# EAGLE schematic sch_v.1 (EAGLE 9.4.2)
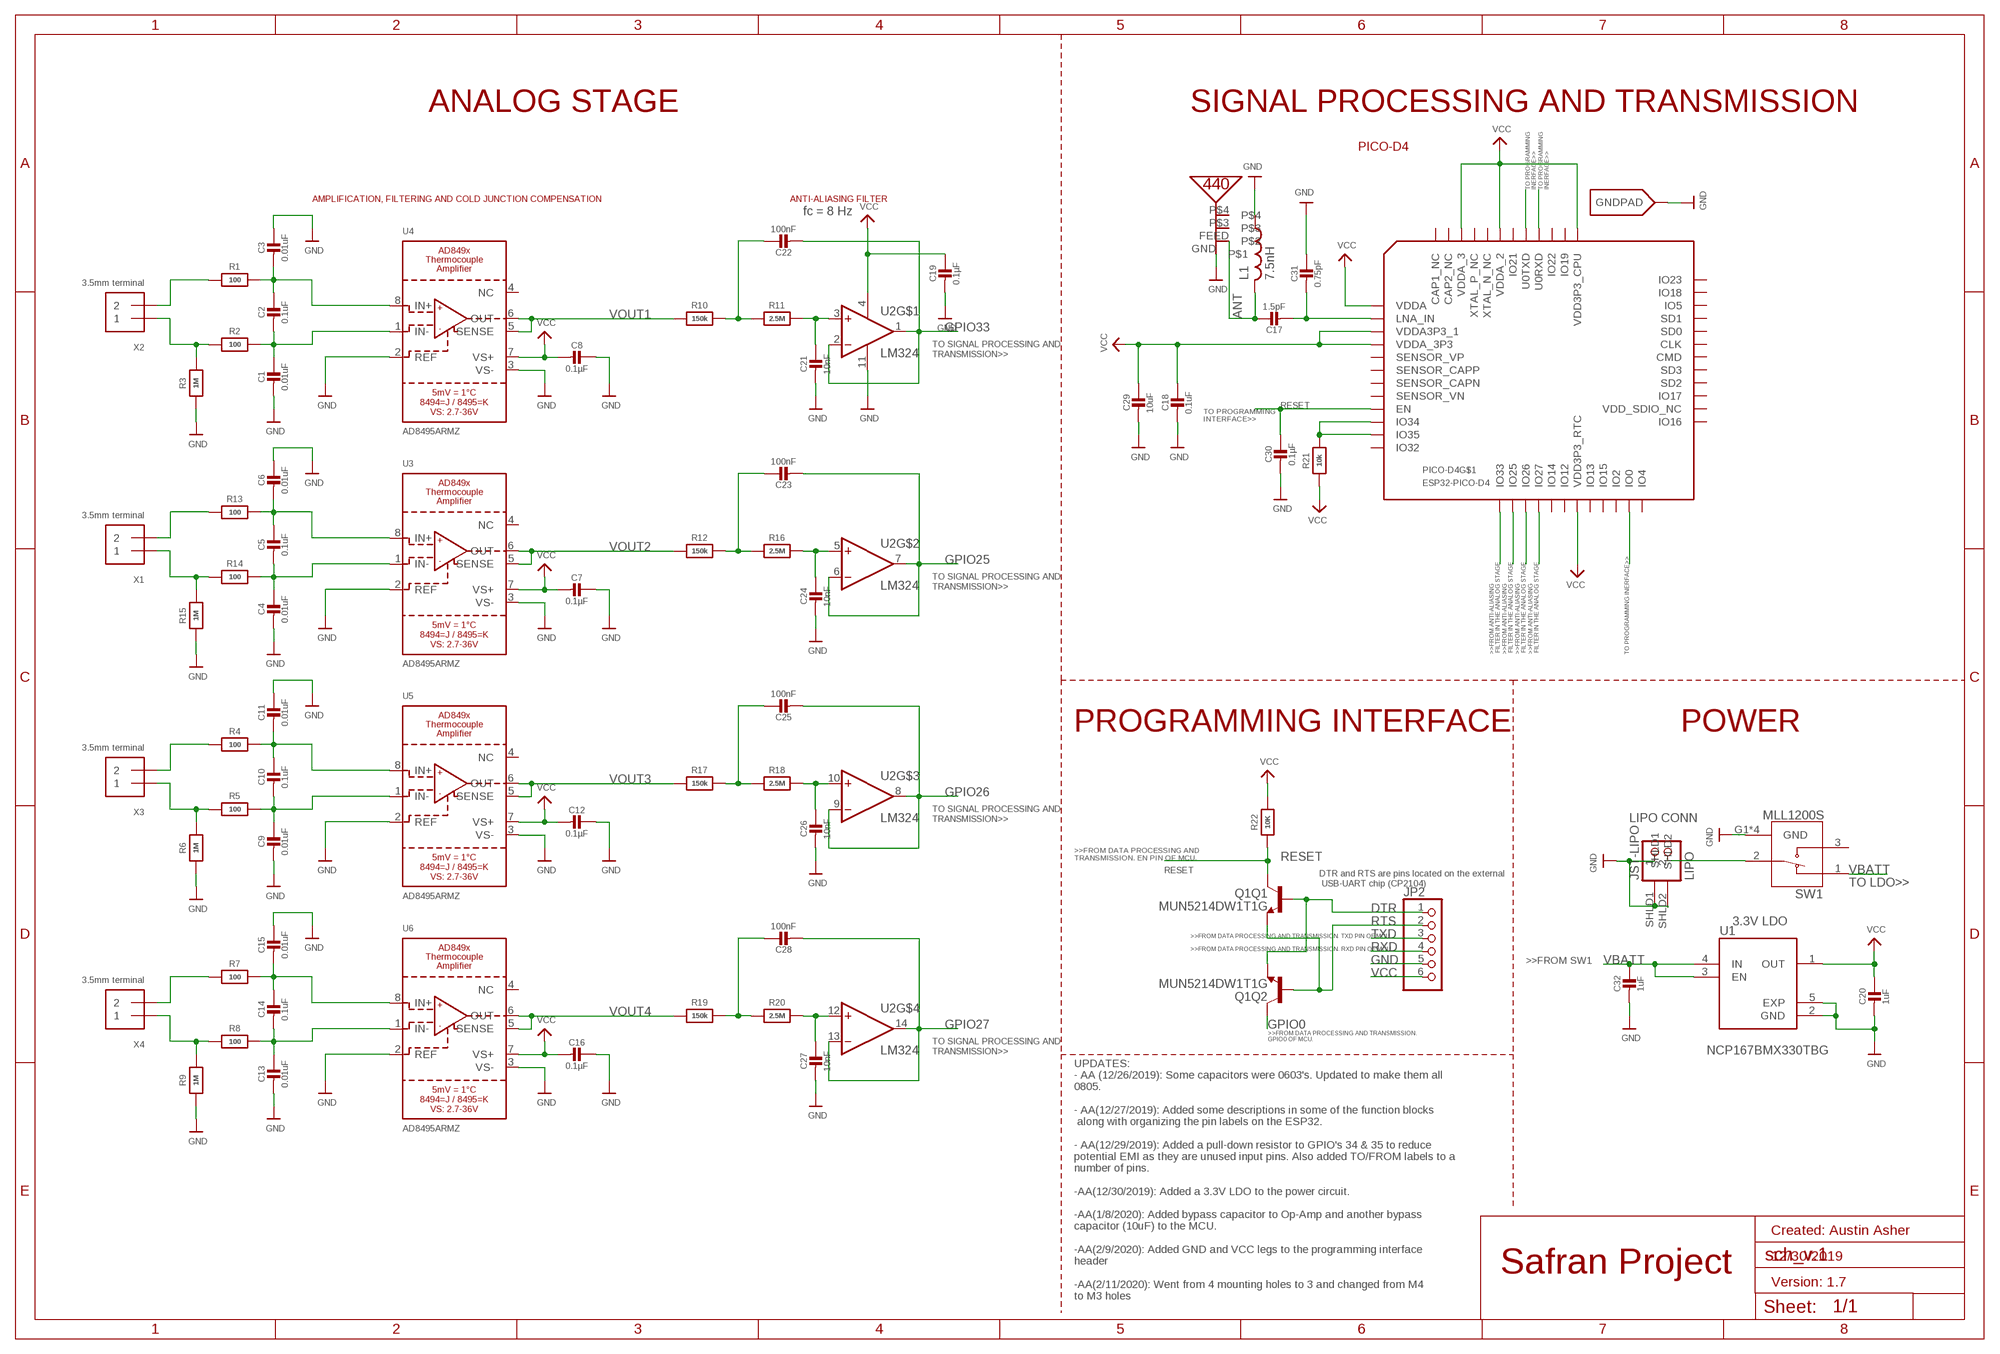
[diagram p0: schematic, sheet 1]

## Parts
C1  0.01uF  CAP_CERAMIC0805-NOOUTLINE  [0805-NO@1]
C2  0.1uF  CAP_CERAMIC0805-NOOUTLINE  [0805-NO@1]
C3  0.01uF  CAP_CERAMIC0805-NOOUTLINE  [0805-NO@1]
C4  0.01uF  CAP_CERAMIC0805-NOOUTLINE  [0805-NO@1]
C5  0.1uF  CAP_CERAMIC0805-NOOUTLINE  [0805-NO@1]
C6  0.01uF  CAP_CERAMIC0805-NOOUTLINE  [0805-NO@1]
C7  0.1µF  CAP_CERAMIC0805-NOOUTLINE  [0805-NO@1]
C8  0.1µF  CAP_CERAMIC0805-NOOUTLINE  [0805-NO@1]
C9  0.01uF  CAP_CERAMIC0805-NOOUTLINE  [0805-NO@1]
C10  0.1uF  CAP_CERAMIC0805-NOOUTLINE  [0805-NO@1]
C11  0.01uF  CAP_CERAMIC0805-NOOUTLINE  [0805-NO@1]
C12  0.1µF  CAP_CERAMIC0805-NOOUTLINE  [0805-NO@1]
C13  0.01uF  CAP_CERAMIC0805-NOOUTLINE  [0805-NO@1]
C14  0.1uF  CAP_CERAMIC0805-NOOUTLINE  [0805-NO@1]
C15  0.01uF  CAP_CERAMIC0805-NOOUTLINE  [0805-NO@1]
C16  0.1µF  CAP_CERAMIC0805-NOOUTLINE  [0805-NO@1]
C17  1.5pF  CAP_CERAMIC0805-NOOUTLINE  [0805-NO@1]
C18  0.1uF  CAP_CERAMIC0805-NOOUTLINE  [0805-NO@1]
C19  0.1µF  CAP_CERAMIC0805-NOOUTLINE  [0805-NO@1]
C20  1uF  CAP_CERAMIC0805-NOOUTLINE  [0805-NO@1]
C21  10nF  CAP_CERAMIC0805-NOOUTLINE  [0805-NO@1]
C22  100nF  CAP_CERAMIC0805-NOOUTLINE  [0805-NO@1]
C23  100nF  CAP_CERAMIC0805-NOOUTLINE  [0805-NO@1]
C24  10nF  CAP_CERAMIC0805-NOOUTLINE  [0805-NO@1]
C25  100nF  CAP_CERAMIC0805-NOOUTLINE  [0805-NO@1]
C26  10nF  CAP_CERAMIC0805-NOOUTLINE  [0805-NO@1]
C27  10nF  CAP_CERAMIC0805-NOOUTLINE  [0805-NO@1]
C28  100nF  CAP_CERAMIC0805-NOOUTLINE  [0805-NO@1]
C29  10uF  CAP_CERAMIC0805-NOOUTLINE  [0805-NO@1]
C30  0.1µF  CAP_CERAMIC0805-NOOUTLINE  [0805-NO@1]
C31  0.75pF  CAP_CERAMIC0805-NOOUTLINE  [0805-NO@1]
C32  1uF  CAP_CERAMIC0805-NOOUTLINE  [0805-NO@1]
JP2  PINHD-1X6  [1X06]
JST-LIPO  LIPO  JST_2PIN  [JSTPH2]
L1  7.5nH  INDUCTOR_0402_N  [RESC0402_N]
PICO-D4  ESP32-PICO-D4  [PICO-D4-QFN48]
Q1  MUN5214DW1T1G  MBT3904DW1T1  [DUAL_NPN_SC70-6]
R1  100  RESISTOR0805_NOOUTLINE  [0805-NO]
R2  100  RESISTOR0805_NOOUTLINE  [0805-NO]
R3  1M  RESISTOR0805_NOOUTLINE  [0805-NO]
R4  100  RESISTOR0805_NOOUTLINE  [0805-NO]
R5  100  RESISTOR0805_NOOUTLINE  [0805-NO]
R6  1M  RESISTOR0805_NOOUTLINE  [0805-NO]
R7  100  RESISTOR0805_NOOUTLINE  [0805-NO]
R8  100  RESISTOR0805_NOOUTLINE  [0805-NO]
R9  1M  RESISTOR0805_NOOUTLINE  [0805-NO]
R10  150k  RESISTOR0805_NOOUTLINE  [0805-NO]
R11  2.5M  RESISTOR0805_NOOUTLINE  [0805-NO]
R12  150k  RESISTOR0805_NOOUTLINE  [0805-NO]
R13  100  RESISTOR0805_NOOUTLINE  [0805-NO]
R14  100  RESISTOR0805_NOOUTLINE  [0805-NO]
R15  1M  RESISTOR0805_NOOUTLINE  [0805-NO]
R16  2.5M  RESISTOR0805_NOOUTLINE  [0805-NO]
R17  150k  RESISTOR0805_NOOUTLINE  [0805-NO]
R18  2.5M  RESISTOR0805_NOOUTLINE  [0805-NO]
R19  150k  RESISTOR0805_NOOUTLINE  [0805-NO]
R20  2.5M  RESISTOR0805_NOOUTLINE  [0805-NO]
R21  10k  RESISTOR0805_NOOUTLINE  [0805-NO]
R22  10K  RESISTOR0805_NOOUTLINE  [0805-NO]
SW1  MLL1200S  [SW_MLL1200S]
U1  NCP170AMX300TCG  [VREG_NCP170AMX300TCG]
U2  LM324  [SOIC127P600X175-14N]
U3  AD8495ARMZ  AD849X  [MSOP8_0.65MM]
U4  AD8495ARMZ  AD849X  [MSOP8_0.65MM]
U5  AD8495ARMZ  AD849X  [MSOP8_0.65MM]
U6  AD8495ARMZ  AD849X  [MSOP8_0.65MM]
U$35  PRO-OB-440  [PRO-OB-440]
X1  3.5mm terminal  TERMBLOCK_1X2  [TERMBLOCK_1X2-3.5MM]
X2  3.5mm terminal  TERMBLOCK_1X2  [TERMBLOCK_1X2-3.5MM]
X3  3.5mm terminal  TERMBLOCK_1X2  [TERMBLOCK_1X2-3.5MM]
X4  3.5mm terminal  TERMBLOCK_1X2  [TERMBLOCK_1X2-3.5MM]

## Nets
ANT: C17.1 L1.2 U$35.FEED
DTR: JP2.1 Q1.1(Q2:E) Q1.5(Q1:B)
GND: C1.2 C3.1 C4.2 C6.1 C7.1 C8.1 C9.2 C11.1 C12.1 C13.2 C15.1 C16.1 C18.2 C19.2 C20.2 C21.2 C24.2 C26.2 C27.2 C29.2 C30.2 C31.1 C32.2 JP2.5 JST-LIPO.1 JST-LIPO.SHLD1 JST-LIPO.SHLD2 L1.1 PICO-D4.EXP(GNDPAD) R3.1 R6.1 R9.1 R15.1 SW1.G1(GND) SW1.G2(GND) SW1.G3(GND) SW1.G4(GND) U1.2(GND) U1.5(EXP) U2.11(VCC-) U3.2(REF) U3.3(VS-) U4.2(REF) U4.3(VS-) U5.2(REF) U5.3(VS-) U6.2(REF) U6.3(VS-) U$35.GND
GPIO0: PICO-D4.23(IO0) Q1.6(Q2:C)
GPIO25: C23.2 U2.6(INVERTING_INPUT2) U2.7(OUTPUT2)
GPIO26: C25.2 U2.8(OUTPUT3) U2.9(INVERTING_INPUT3)
GPIO27: C28.2 U2.13(INVERTING_INPUT4) U2.14(OUTPUT4)
GPIO33: C22.2 U2.1(OUTPUT1) U2.2(INVERTING_INPUT1)
IN+: R13.1 X1.2
IN+1: R1.1 X2.2
IN+2: R4.1 X3.2
IN+3: R7.1 X4.2
IN-: R14.1 R15.2 X1.1
IN-1: R2.1 R3.2 X2.1
IN-2: R5.1 R6.2 X3.1
IN-3: R8.1 R9.2 X4.1
LNA_IN: C17.2 C31.2 PICO-D4.2(LNA_IN)
N$1: C2.1 C3.2 R1.2 U4.8(IN+)
N$2: C5.1 C6.2 R13.2 U3.8(IN+)
N$3: C4.1 C5.2 R14.2
N$4: U3.1(IN-)
N$5: C1.1 C2.2 R2.2 U4.1(IN-)
N$7: C10.1 C11.2 R4.2 U5.8(IN+)
N$8: C9.1 C10.2 R5.2
N$9: U5.1(IN-)
N$10: C14.1 C15.2 R7.2 U6.8(IN+)
N$11: C13.1 C14.2 R8.2
N$12: U6.1(IN-)
N$13: JST-LIPO.2 SW1.2
N$14: C22.1 R10.2 R11.1
N$15: PICO-D4.13(IO33)
N$16: C21.1 R11.2 U2.3(NON-INVERTING_INPUT1)
N$17: C24.1 R16.2 U2.5(NON-INVERTING_INPUT2)
N$18: C23.1 R12.2 R16.1
N$19: PICO-D4.14(IO25)
N$20: C25.1 R17.2 R18.1
N$21: C28.1 R19.2 R20.1
N$22: C26.1 R18.2 U2.10(NON-INVERTING_INPUT3)
N$23: C27.1 R20.2 U2.12(NON-INVERTING_INPUT4)
N$24: PICO-D4.15(IO26)
N$25: PICO-D4.16(IO27)
N$26: PICO-D4.10(IO34) PICO-D4.11(IO35) R21.2
RESET: C30.1 PICO-D4.9(EN) Q1.3(Q1:C) R22.1
RTS: JP2.2 Q1.2(Q2:B) Q1.4(Q1:E)
RXD: JP2.4 PICO-D4.40(U0RXD)
TXD: JP2.3 PICO-D4.41(U0TXD)
VBATT: C32.1 SW1.1 U1.3(EN) U1.4(IN)
VCC: C7.2 C8.2 C12.2 C16.2 C18.1 C19.1 C20.1 C29.1 JP2.6 PICO-D4.1(VDDA) PICO-D4.3(VDDA3P3_1) PICO-D4.4(VDDA_3P3) PICO-D4.19(VDD3P3_RTC) PICO-D4.37(VDD3P3_CPU) PICO-D4.43(VDDA_2) PICO-D4.46(VDDA_3) R21.1 R22.2 U1.1(OUT) U2.4(VCC+) U3.7(VS+) U4.7(VS+) U5.7(VS+) U6.7(VS+)
VOUT1: R10.1 U4.5(SENSE) U4.6(OUT)
VOUT2: R12.1 U3.5(SENSE) U3.6(OUT)
VOUT3: R17.1 U5.5(SENSE) U5.6(OUT)
VOUT4: R19.1 U6.5(SENSE) U6.6(OUT)
Unconnected: PICO-D4.5(SENSOR_VP) PICO-D4.6(SENSOR_CAPP) PICO-D4.8(SENSOR_VN) PICO-D4.12(IO32) PICO-D4.17(IO14) PICO-D4.20(IO13) PICO-D4.21(IO15) PICO-D4.22(IO2) PICO-D4.24(IO4) PICO-D4.25(IO16) PICO-D4.26(VDD_SDIO_NC) PICO-D4.27(IO17) PICO-D4.28(SD2) PICO-D4.29(SD3) PICO-D4.30(CMD) PICO-D4.31(CLK) PICO-D4.32(SD0) PICO-D4.33(SD1) PICO-D4.34(IO5) PICO-D4.35(IO18) PICO-D4.36(IO23) PICO-D4.38(IO19) PICO-D4.39(IO22) PICO-D4.44(XTAL_N_NC) PICO-D4.45(XTAL_P_NC) PICO-D4.47(CAP2_NC) PICO-D4.48(CAP1_NC) SW1.3 U3.4(NC) U4.4(NC) U5.4(NC) U6.4(NC) U$35.P$3 U$35.P$4

## Notes on the sheet
- ANALOG STAGE | SIGNAL PROCESSING AND TRANSMISSION
- PICO-D4
- TO PROGRAMMING
  INERFACE>>
- TO PROGRAMMING
  INERFACE>>
- AMPLIFICATION, FILTERING AND COLD JUNCTION COMPENSATION | ANTI-ALIASING FILTER
- fc = 8 Hz
- TO SIGNAL PROCESSING AND 
  TRANSMISSION>>
- TO PROGRAMMING 
  INTERFACE>>
- TO SIGNAL PROCESSING AND 
  TRANSMISSION>>
- >>FROM ANTI-ALIASING
   FILTER IN THE ANALOG STAGE
- >>FROM ANTI-ALIASING
   FILTER IN THE ANALOG STAGE
- >>FROM ANTI-ALIASING
   FILTER IN THE ANALOG STAGE
- >>FROM ANTI-ALIASING
   FILTER IN THE ANALOG STAGE
- TO PROGRAMMING INERFACE>>
- PROGRAMMING INTERFACE | POWER
- TO SIGNAL PROCESSING AND 
  TRANSMISSION>>
- LIPO CONN
- >>FROM DATA PROCESSING AND
  TRANSMISSION. EN PIN OF MCU.
- DTR and RTS are pins located on the external
   USB-UART chip (CP2104)
- TO LDO>>
- 3.3V LDO
- >>FROM DATA PROCESSING AND TRANSMISSION. TXD PIN OF MCU.
- >>FROM DATA PROCESSING AND TRANSMISSION. RXD PIN OF MCU.
- >>FROM SW1
- >>FROM DATA PROCESSING AND TRANSMISSION. 
  GPIO0 OF MCU.
- TO SIGNAL PROCESSING AND 
  TRANSMISSION>>
- NCP167BMX330TBG
- NCP167BMX330TBG
- NCP167BMX330TBG
- Created: Austin Asher
- 12/30/2019
- Safran Project
- Version: 1.7
- UPDATES:
  - AA (12/26/2019): Some capacitors were 0603's. Updated to make them all 
  0805.
  
  - AA(12/27/2019): Added some descriptions in some of the function blocks
   along with organizing the pin labels on the ESP32.
  
  - AA(12/29/2019): Added a pull-down resistor to GPIO's 34 & 35 to reduce
  potential EMI as they are unused input pins. Also added TO/FROM labels to a 
  number of pins.
  
  -AA(12/30/2019): Added a 3.3V LDO to the power circuit.
  
  -AA(1/8/2020): Added bypass capacitor to Op-Amp and another bypass
  capacitor (10uF) to the MCU.
  
  -AA(2/9/2020): Added GND and VCC legs to the programming interface 
  header
  
  -AA(2/11/2020): Went from 4 mounting holes to 3 and changed from M4 
  to M3 holes

## Power pins joined to a net without a drawn wire
IO12: PICO-D4.18(IO12)
IO21: PICO-D4.42(IO21)
SENSOR_CAPN: PICO-D4.7(SENSOR_CAPN)

## Library data of the parts
C1-C32 = microbuilder:CAP_CERAMIC: Ceramic Capacitors For new designs, use the packages preceded by an '_' character since they are more reliable: The following footprints should be used on most boards: _0402 - Standard footprint for regular board layouts _0603 - Standard footprint for regular board layouts _0805 - Standard footprint for regular board layouts _1206 - Standard footprint for regular board layouts For extremely tight-pitch boards where space is at a premium, the following 'micro-pitch' footprints can be used (smaller pads, no silkscreen outline, etc.): _0402MP - Micro-pitch footprint for very dense/compact boards _0603MP - Micro-pitch footprint for very dense/compact boards _0805MP - Micro-pitch footprint for very dense/compact boards _1206MP - Micro-pitch footprint for very dense/compact boards
JP2 = adafruit:PINHD-1X6: PIN HEADER
JST-LIPO = UnexpectedMaker:JST_2PIN: JST 2-Pin Right-Angle Connector PH-Series - 4UConnector: 17311 SH-Series - 4UConnector: 07278
L1 = Nordic_nRF:INDUCTOR: Generic chip inductor
PICO-D4 = UnexpectedMaker:ESP32-PICO-D4
Q1 = UnexpectedMaker:MBT3904DW1T1: MBT3904DW1 Dual NPN Transistors The MBT3904W1 puts two general purpose 3904 NPN transistors in a single package. Datasheet <http://www.onsemi.com/pub_link/Collateral/MBT3904DW1T1-D.PDF>; PROD_ID: TRANS-13337
R1-R22 = microbuilder:RESISTOR: Resistors For new designs, use the packages preceded by an '_' character since they are more reliable: The following footprints should be used on most boards: _0402 - Standard footprint for regular board layouts _0603 - Standard footprint for regular board layouts _0805 - Standard footprint for regular board layouts _1206 - Standard footprint for regular board layouts For extremely tight-pitch boards where space is at a premium, the following 'micro-pitch' footprints can be used (smaller pads, no silkscreen outline, etc.): _0402MP - Micro-pitch footprint for very dense/compact boards _0603MP - Micro-pitch footprint for very dense/compact boards _0805MP - Micro-pitch footprint for very dense/compact boards _1206MP - Micro-pitch footprint for very dense/compact boards
SW1 = MLL1200S:MLL1200S: Switch Slide SPDT Side Slide 0.3A 4VDC Gull Wing SMD Box; AVAILABILITY: Unavailable; COMMENT: 1437575-1; DESCRIPTION: Slide Switch SPDT Surface Mount, Right Angle; MF: TE Connectivity; MP: MLL1200S; PACKAGE: None; PRICE: None; TE_PURCHASE_URL: https://www.te.com/usa-en/product-1437575-1.html?te_bu=Cor&te_type=disp&te_campaign=seda_glo_cor-seda-global-disp-prtnr-fy19-seda-model-bom-cta_sma-317_1&elqCampaignId=32493
U1 = NCP170AMX300TCG:NCP170AMX300TCG: Fixed LDO Voltage Regulator, 2.2V to 5.5V, 190mV Dropout, 3Vout, 150mAout, XDFN-4; AVAILABILITY: Unavailable; DESCRIPTION: Fixed LDO Voltage Regulator, 2.2V to 5.5V, 190mV Dropout, 3Vout, 150mAout, XDFN-4; MF: ON Semiconductor; MP: NCP170AMX300TCG; PACKAGE: XDFN-4 ON Semiconductor; PRICE: None
U2 = LM324:LM324: these devices consist of four independent high-gain frequency-compensated operational amplifiers that are designed sp...; AVAILABILITY: Unavailable; DESCRIPTION: these devices consist of four independent high-gain frequency-compensated operational amplifiers that are designed sp...; MF: Texas Instruments; MP: LM324; PACKAGE: SOIC-14 Texas Instruments; PRICE: None
U3-U6 = microbuilder:AD849X: AD8494/8495 - Precision Thermocouple Amplifier with Cold Junction Compensation For J-Type Thermocouples use AD8494, For K-Type use AD8495 5 mV/°C thermometer output Single Supply: 2.7 V to 36 V Dual Supply: ±2.7 V to ±18 V
U$35 = UnexpectedMaker:PRO-OB-440
X1-X4 = microbuilder:TERMBLOCK_1X2: 3.5mm Terminal block http://www.ladyada.net/library/pcb/eaglelibrary.html

## Module TEST
Ports: 

### Library data of the parts